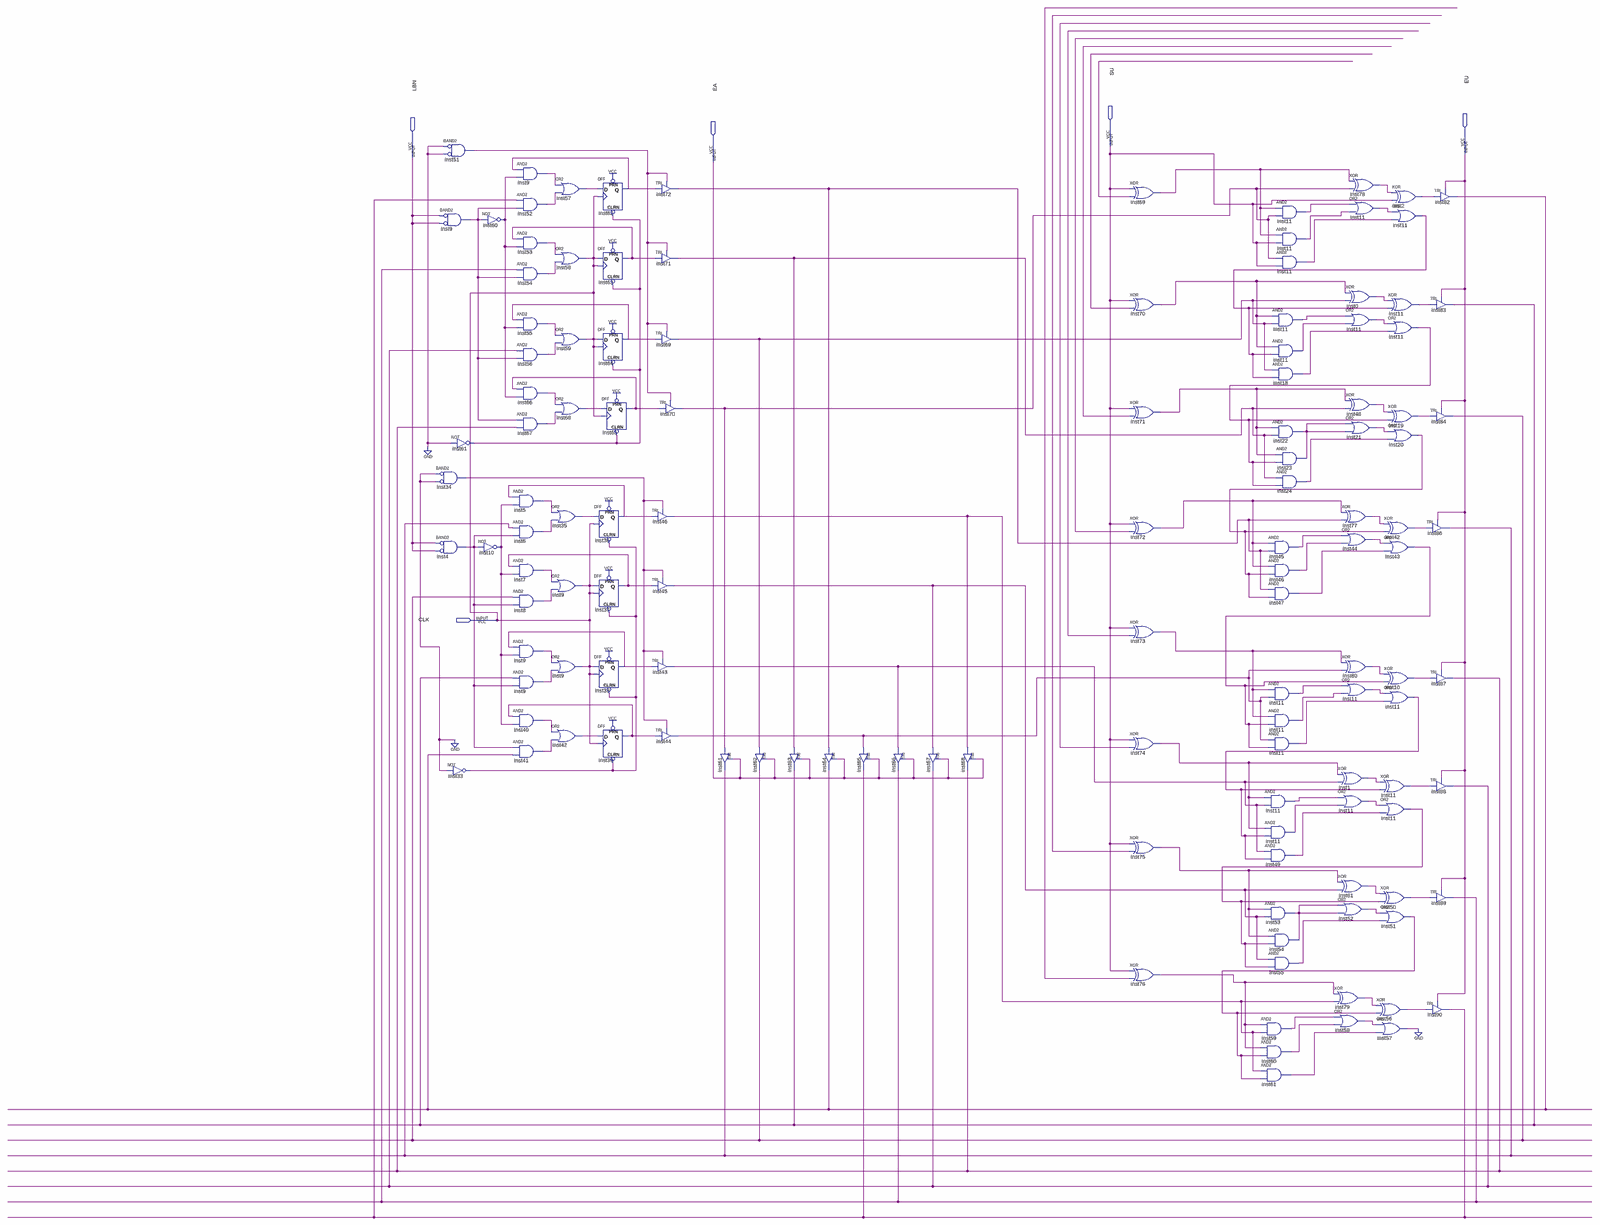
[diagram p0: schematic sheet, whole]
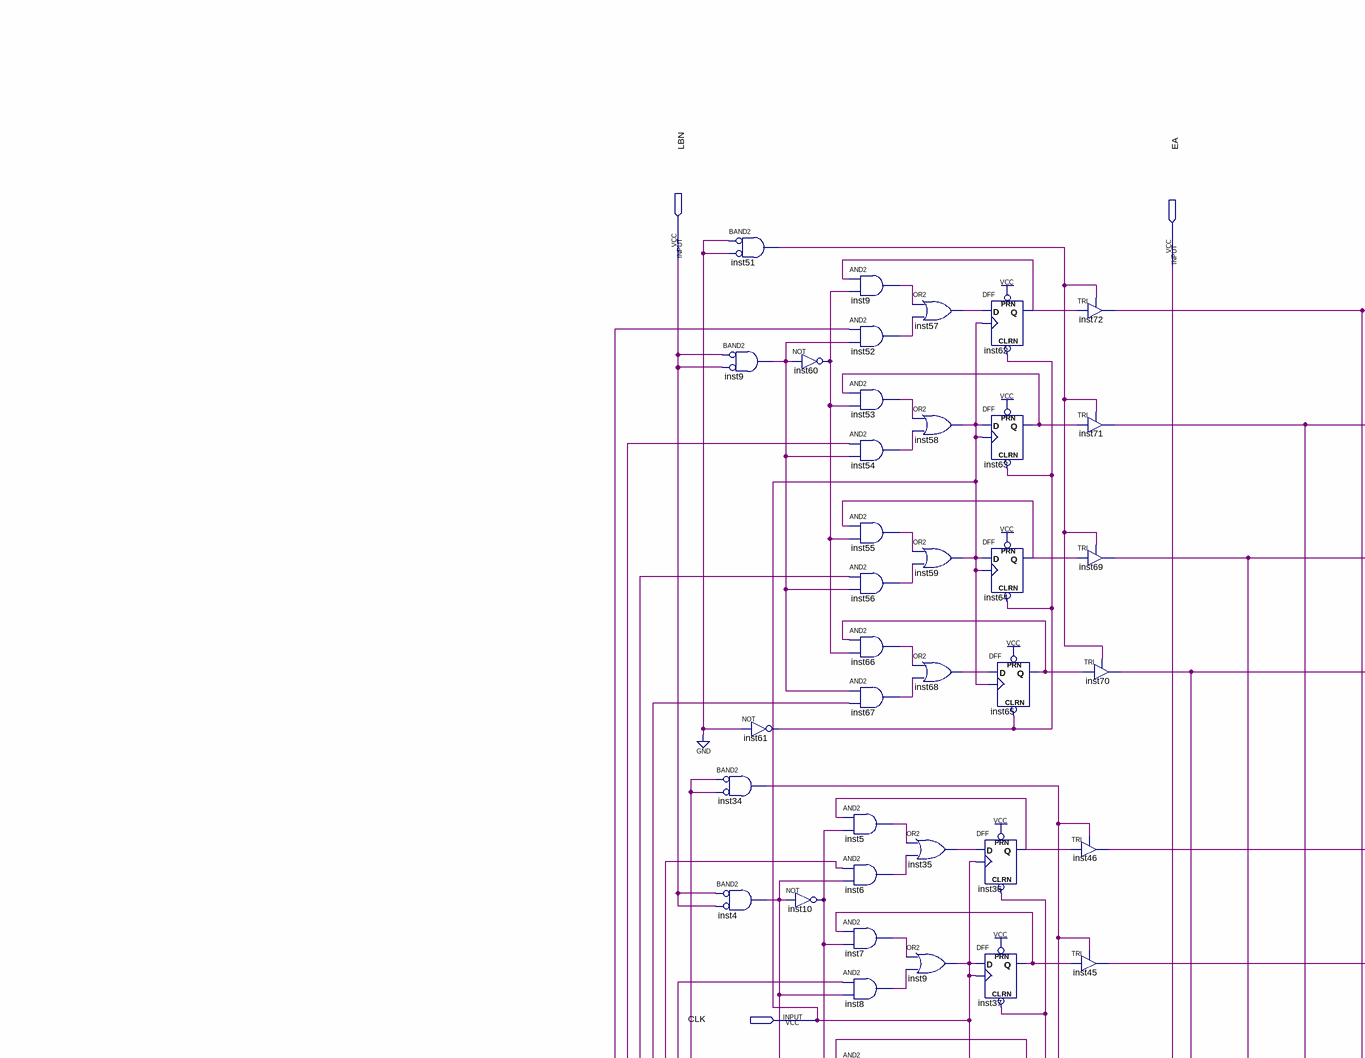
[diagram p1: schematic sheet, upper left part]
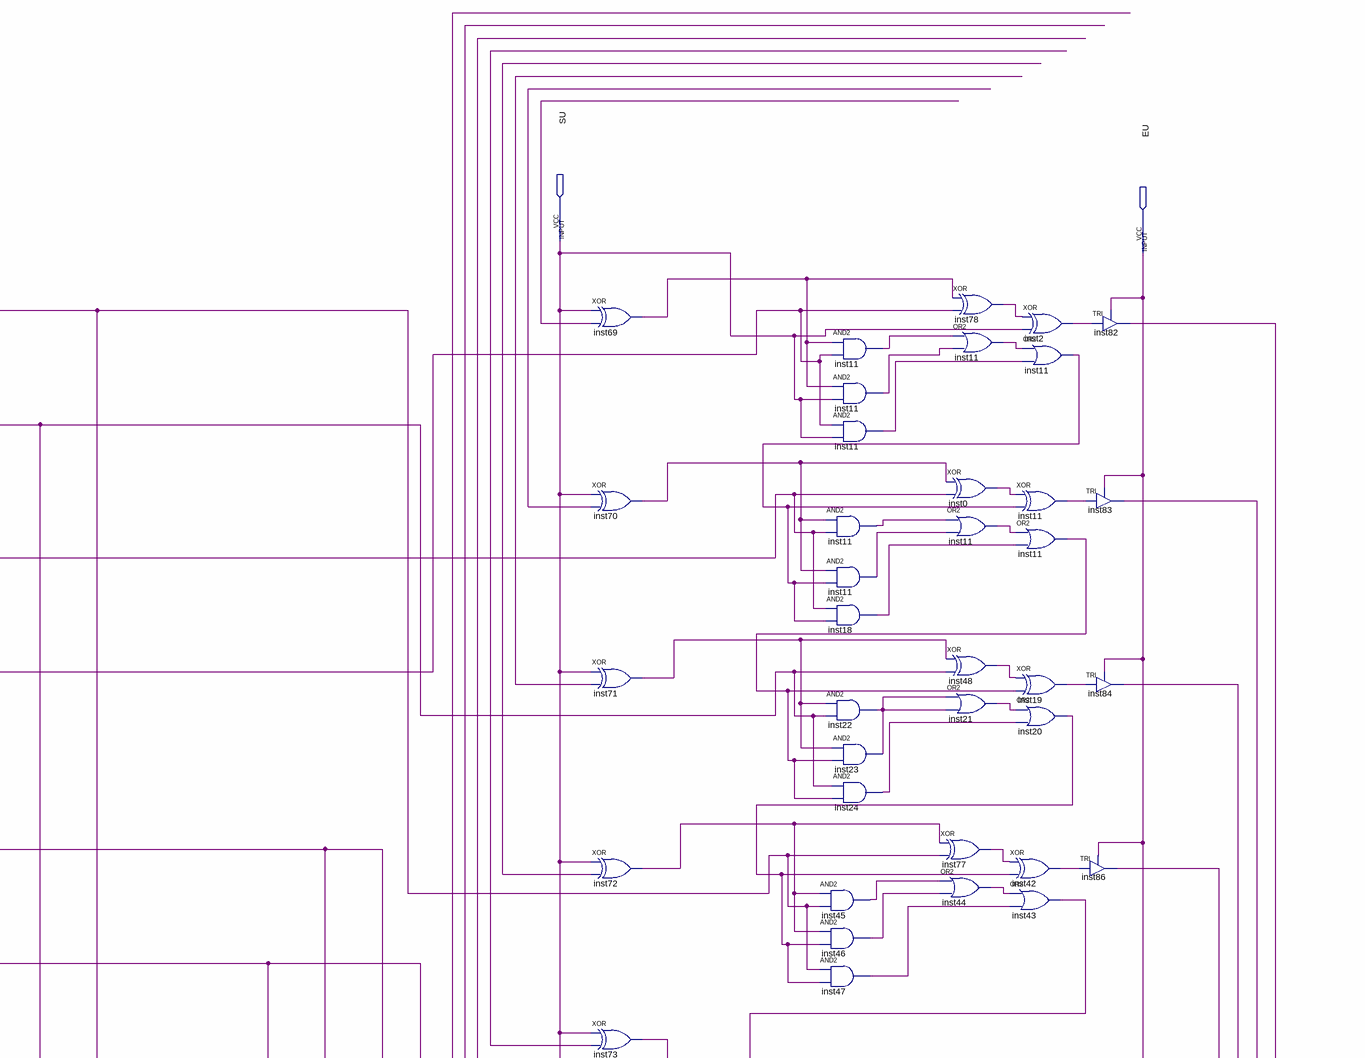
[diagram p2: schematic sheet, upper right part]
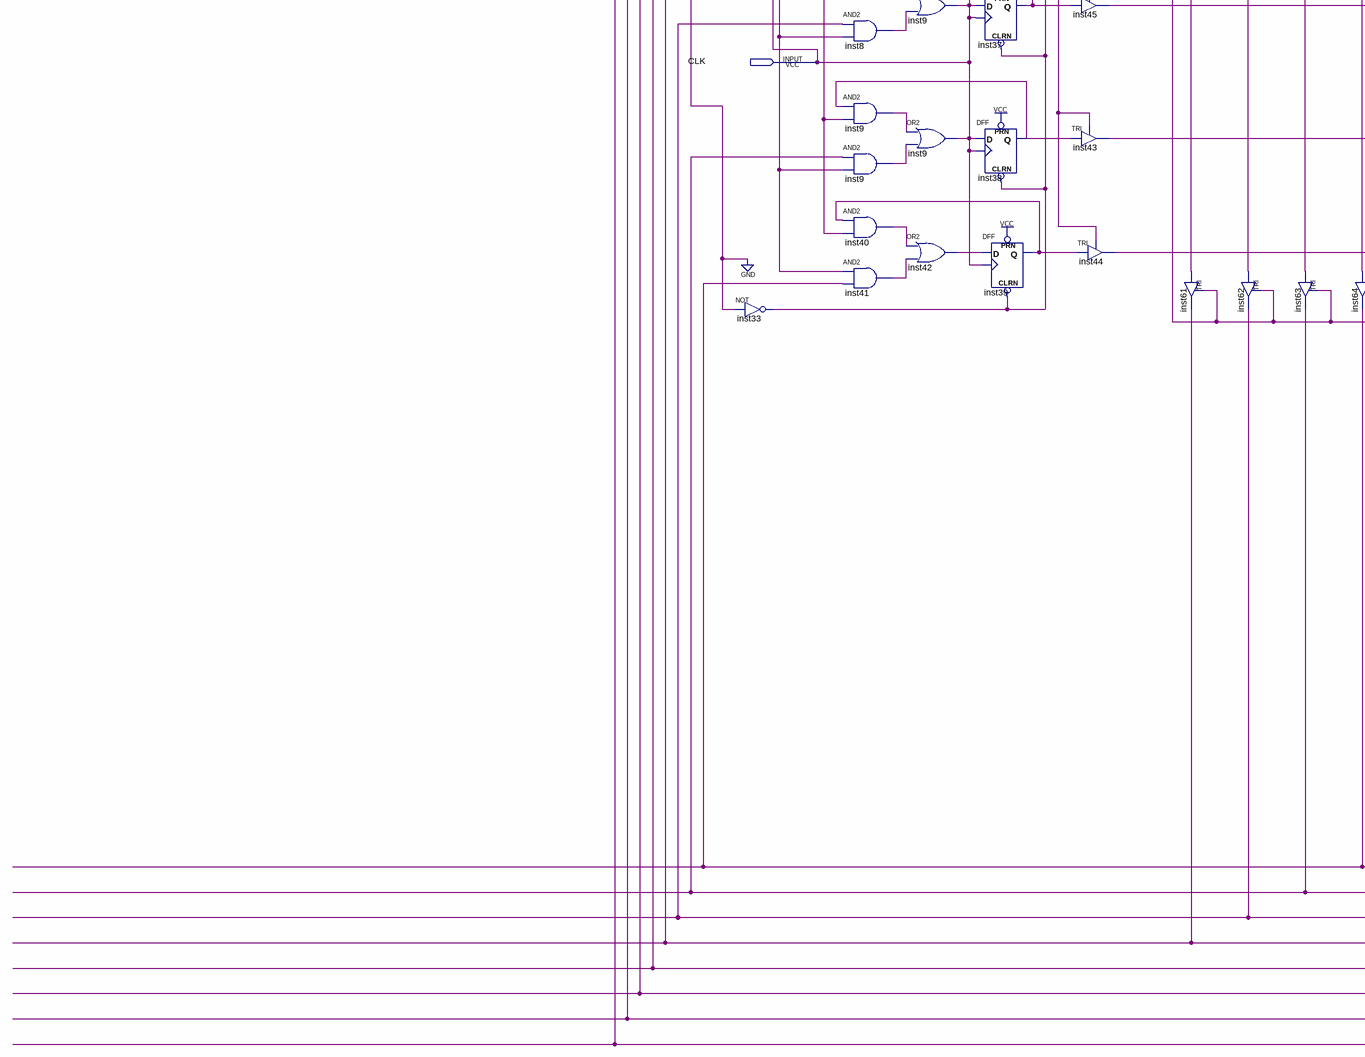
[diagram p3: schematic sheet, lower left part]
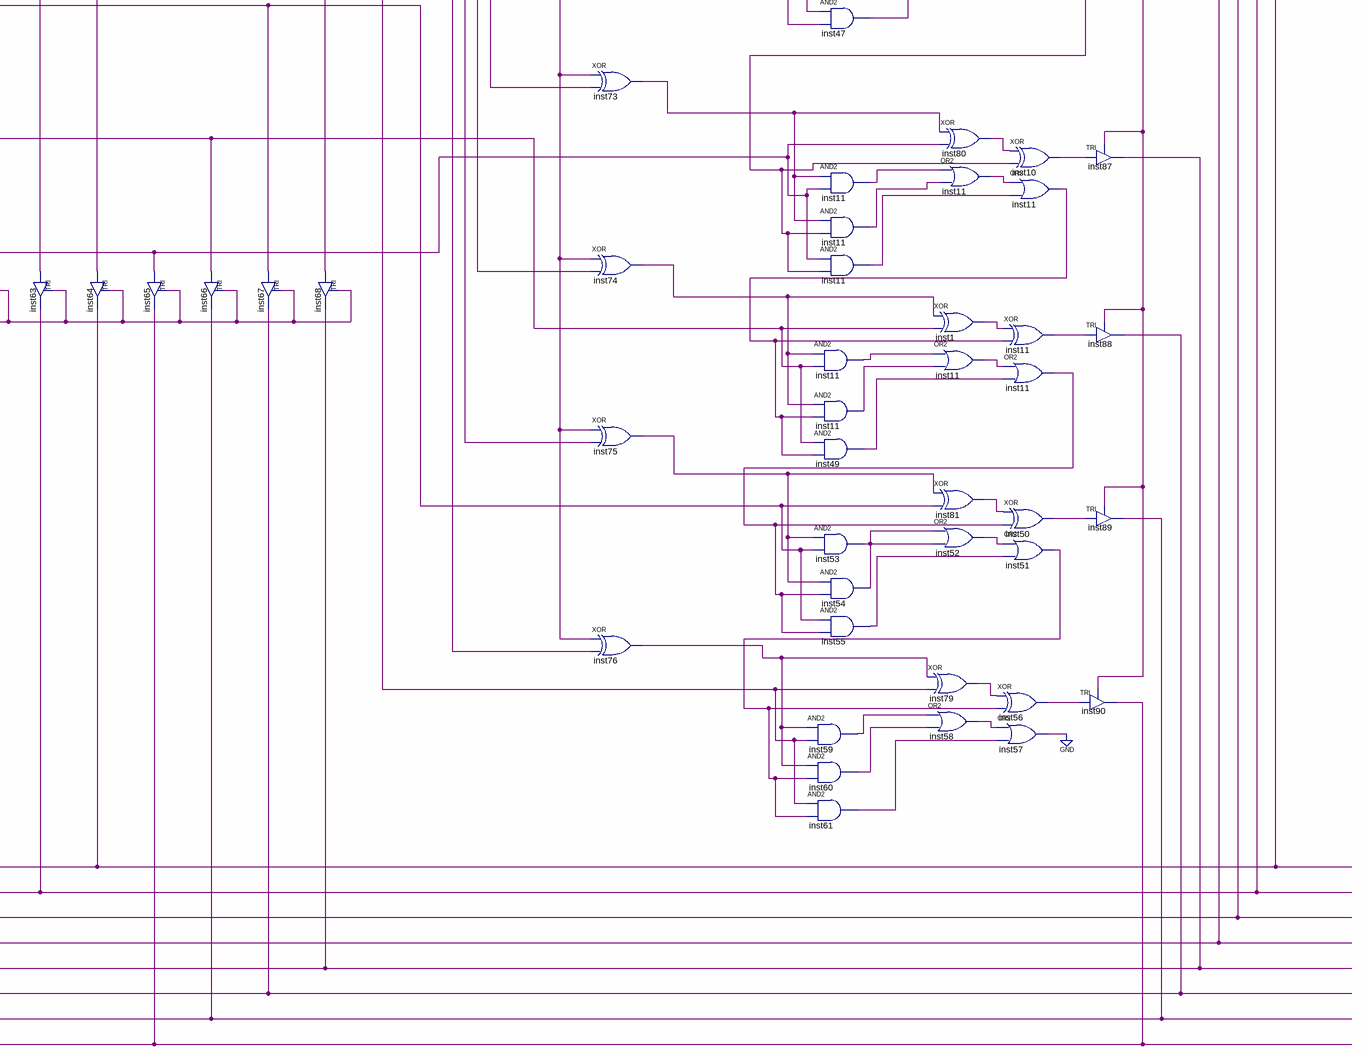
[diagram p4: schematic sheet, lower right part]
// Quartus schematic Somador_subtrador_acumulador.bdf as structural Verilog: 128 symbols, 5 pins
module Somador_subtrador_acumulador (
  input  SU,
  input  EU,
  input  LBN,
  input  EA,
  input  CLK
);

  wire inst0_out, inst1_out, inst2_out, inst4_out, inst5_out, inst6_out, inst7_out, inst8_out, inst9_out,
       inst9_out_2, inst9_out_3, inst9_out_4, inst10_out, inst10_out_2, inst11_out, inst11_out_2,
       inst11_out_3, inst11_out_4, inst11_out_5, inst11_out_6, inst11_out_7, inst11_out_8, inst11_out_9,
       inst11_out_10, inst11_out_11, inst11_out_12, inst11_out_13, inst11_out_14, inst11_out_15,
       inst11_out_16, inst11_out_17, inst11_out_18, inst11_out_19, inst11_out_20, inst18_out, inst19_out,
       inst20_out, inst21_out, inst22_out, inst24_out, inst33_out, inst34_out, inst35_out, inst36_q,
       inst37_q, inst38_q, inst39_q, inst40_out, inst41_out, inst42_out, inst42_out_2, inst43_out,
       inst43_out_2, inst44_out, inst44_out_2, inst45_out, inst45_out_2, inst46_out, inst46_out_2,
       inst47_out, inst48_out, inst49_out, inst50_out, inst51_out, inst51_out_2, inst52_out, inst52_out_2,
       inst53_out, inst53_out_2, inst54_out, inst55_out, inst55_out_2, inst56_out, inst56_out_2, inst57_out,
       inst57_out_2, inst58_out, inst59_out, inst60_out, inst60_out_2, inst61_out, inst61_out_2,
       inst61_out_3, inst62_out, inst62_q, inst63_out, inst63_q, inst64_out, inst64_q, inst65_out, inst65_q,
       inst66_out, inst66_out_2, inst67_out, inst67_out_2, inst68_out, inst68_out_2, inst69_out,
       inst69_out_2, inst70_out, inst70_out_2, inst71_out, inst71_out_2, inst72_out, inst72_out_2,
       inst73_out, inst74_out, inst75_out, inst76_out, inst77_out, inst78_out, inst79_out, inst80_out,
       inst81_out, undriven, undriven_2, undriven_3, undriven_4, undriven_5, undriven_6, undriven_7,
       undriven_8;

  and inst51 (inst51_out, ~1'b0, ~1'b0);  // BAND2
  and inst9 (inst9_out_4, ~LBN, ~LBN);  // BAND2
  not inst61 (inst61_out, 1'b0);
  and inst34 (inst34_out, ~1'b0, ~1'b0);  // BAND2
  and inst4 (inst4_out, ~LBN, ~LBN);  // BAND2
  not inst33 (inst33_out, 1'b0);
  not inst60 (inst60_out, inst9_out_4);
  not inst10 (inst10_out, inst4_out);
  and inst5 (inst5_out, inst36_q, inst10_out);
  and inst6 (inst6_out, inst61_out_3, inst4_out);
  and inst7 (inst7_out, inst37_q, inst10_out);
  and inst8 (inst8_out, inst62_out, inst4_out);
  and inst9_dup2 (inst9_out_2, inst38_q, inst10_out);
  and inst9_dup3 (inst9_out, inst63_out, inst4_out);
  and inst40 (inst40_out, inst39_q, inst10_out);
  and inst41 (inst41_out, inst4_out, inst64_out);
  and inst9_dup4 (inst9_out_3, inst62_q, inst60_out);
  and inst52 (inst52_out, inst65_out, inst9_out_4);
  and inst53 (inst53_out, inst63_q, inst60_out);
  and inst54 (inst54_out, inst66_out_2, inst9_out_4);
  and inst55 (inst55_out, inst64_q, inst60_out);
  and inst56 (inst56_out, inst67_out_2, inst9_out_4);
  and inst66 (inst66_out, inst65_q, inst60_out);
  and inst67 (inst67_out, inst9_out_4, inst68_out_2);
  or inst57 (inst57_out, inst9_out_3, inst52_out);
  or inst58 (CLK, inst53_out, inst54_out);
  or inst59 (CLK, inst55_out, inst56_out);
  or inst68 (inst68_out, inst66_out, inst67_out);
  or inst35 (inst35_out, inst5_out, inst6_out);
  or inst9_dup5 (CLK, inst7_out, inst8_out);
  or inst9_dup6 (CLK, inst9_out_2, inst9_out);
  or inst42 (inst42_out, inst40_out, inst41_out);
  DFF inst62 (.CLRN(inst61_out), .CLK(CLK), .D(inst57_out), .PRN(1'b1), .Q(inst62_q));
  DFF inst63 (.CLRN(inst61_out), .CLK(CLK), .D(CLK), .PRN(1'b1), .Q(inst63_q));
  DFF inst64 (.CLRN(inst61_out), .CLK(CLK), .D(CLK), .PRN(1'b1), .Q(inst64_q));
  DFF inst65 (.CLRN(inst61_out), .CLK(CLK), .D(inst68_out), .PRN(1'b1), .Q(inst65_q));
  DFF inst36 (.CLRN(inst33_out), .CLK(CLK), .D(inst35_out), .PRN(1'b1), .Q(inst36_q));
  DFF inst37 (.CLRN(inst33_out), .CLK(CLK), .D(CLK), .PRN(1'b1), .Q(inst37_q));
  DFF inst38 (.CLRN(inst33_out), .CLK(CLK), .D(CLK), .PRN(1'b1), .Q(inst38_q));
  DFF inst39 (.CLRN(inst33_out), .CLK(CLK), .D(inst42_out), .PRN(1'b1), .Q(inst39_q));
  TRI inst72 (.IN(inst62_q), .OE(inst51_out), .OUT(inst72_out));
  TRI inst71 (.IN(inst63_q), .OE(inst51_out), .OUT(inst71_out_2));
  TRI inst69 (.IN(inst64_q), .OE(inst51_out), .OUT(inst69_out_2));
  TRI inst70 (.IN(inst65_q), .OE(inst51_out), .OUT(inst70_out_2));
  TRI inst46 (.IN(inst36_q), .OE(inst34_out), .OUT(inst46_out));
  TRI inst45 (.IN(inst37_q), .OE(inst34_out), .OUT(inst45_out_2));
  TRI inst43 (.IN(inst38_q), .OE(inst34_out), .OUT(inst43_out_2));
  TRI inst44 (.IN(inst39_q), .OE(inst34_out), .OUT(inst44_out_2));
  TRI inst61_dup2 (.IN(inst70_out_2), .OE(EA), .OUT(inst61_out_3));
  TRI inst62_dup2 (.IN(inst69_out_2), .OE(EA), .OUT(inst62_out));
  TRI inst63_dup2 (.IN(inst71_out_2), .OE(EA), .OUT(inst63_out));
  TRI inst64_dup2 (.IN(inst72_out), .OE(EA), .OUT(inst64_out));
  TRI inst65_dup2 (.IN(inst44_out_2), .OE(EA), .OUT(inst65_out));
  TRI inst66_dup2 (.IN(inst43_out_2), .OE(EA), .OUT(inst66_out_2));
  TRI inst67_dup2 (.IN(inst45_out_2), .OE(EA), .OUT(inst67_out_2));
  TRI inst68_dup2 (.IN(inst46_out), .OE(EA), .OUT(inst68_out_2));
  xor inst69_dup2 (inst69_out, SU, undriven);
  xor inst70_dup2 (inst70_out, SU, undriven_2);
  xor inst71_dup2 (inst71_out, SU, undriven_3);
  xor inst72_dup2 (inst72_out_2, SU, undriven_4);
  xor inst73 (inst73_out, SU, undriven_5);
  xor inst74 (inst74_out, SU, undriven_6);
  xor inst75 (inst75_out, SU, undriven_7);
  xor inst76 (inst76_out, SU, undriven_8);
  and inst11 (inst11_out_6, inst69_out, inst70_out_2);
  and inst11_dup2 (inst11_out_7, inst69_out, SU);
  and inst11_dup3 (inst11_out, inst70_out_2, SU);
  and inst11_dup4 (inst11_out_4, inst70_out, inst69_out_2);
  and inst11_dup5 (inst11_out_5, inst70_out, inst11_out_15);
  and inst18 (inst18_out, inst69_out_2, inst11_out_15);
  and inst22 (inst22_out, inst71_out, inst71_out_2);
  and inst23 (inst22_out, inst71_out, inst11_out_16);
  and inst24 (inst24_out, inst71_out_2, inst11_out_16);
  and inst45_dup2 (inst45_out, inst72_out_2, inst72_out);
  and inst46_dup2 (inst46_out_2, inst72_out_2, inst20_out);
  and inst47 (inst47_out, inst72_out, inst20_out);
  and inst11_dup6 (inst11_out_13, inst73_out, inst44_out_2);
  and inst11_dup7 (inst11_out_14, inst73_out, inst43_out);
  and inst11_dup8 (inst11_out_8, inst44_out_2, inst43_out);
  and inst11_dup9 (inst11_out_11, inst74_out, inst43_out_2);
  and inst11_dup10 (inst11_out_12, inst74_out, inst11_out_17);
  and inst49 (inst49_out, inst43_out_2, inst11_out_17);
  and inst53_dup2 (inst53_out_2, inst75_out, inst45_out_2);
  and inst54_dup2 (inst53_out_2, inst75_out, inst11_out_18);
  and inst55_dup2 (inst55_out_2, inst45_out_2, inst11_out_18);
  and inst59_dup2 (inst59_out, inst76_out, inst46_out);
  and inst60_dup2 (inst60_out_2, inst76_out, inst51_out_2);
  and inst61_dup3 (inst61_out_2, inst46_out, inst51_out_2);
  xor inst0 (inst0_out, inst70_out, inst69_out_2);
  or inst11_dup11 (inst11_out_3, inst11_out_4, inst11_out_5);
  xor inst48 (inst48_out, inst71_out, inst71_out_2);
  or inst21 (inst21_out, inst22_out, inst22_out);
  xor inst77 (inst77_out, inst72_out_2, inst72_out);
  or inst44_dup2 (inst44_out, inst45_out, inst46_out_2);
  xor inst80 (inst80_out, inst73_out, inst44_out_2);
  or inst11_dup12 (inst11_out_9, inst11_out_13, inst11_out_14);
  xor inst1 (inst1_out, inst74_out, inst43_out_2);
  or inst11_dup13 (inst11_out_10, inst11_out_11, inst11_out_12);
  xor inst81 (inst81_out, inst75_out, inst45_out_2);
  or inst52_dup2 (inst52_out_2, inst53_out_2, inst53_out_2);
  xor inst79 (inst79_out, inst76_out, inst46_out);
  or inst58_dup2 (inst58_out, inst59_out, inst60_out_2);
  xor inst78 (inst78_out, inst69_out, inst70_out_2);
  or inst11_dup14 (inst11_out_2, inst11_out_6, inst11_out_7);
  xor inst56_dup2 (inst56_out_2, inst79_out, inst51_out_2);
  or inst57_dup2 (inst57_out_2, inst58_out, inst61_out_2);
  xor inst2 (inst2_out, inst78_out, SU);
  or inst11_dup15 (inst11_out_15, inst11_out_2, inst11_out);
  xor inst11_dup16 (inst11_out_19, inst0_out, inst11_out_15);
  or inst11_dup17 (inst11_out_16, inst11_out_3, inst18_out);
  xor inst19 (inst19_out, inst48_out, inst11_out_16);
  or inst20 (inst20_out, inst21_out, inst24_out);
  xor inst42_dup2 (inst42_out_2, inst77_out, inst20_out);
  or inst43_dup2 (inst43_out, inst44_out, inst47_out);
  xor inst10_dup2 (inst10_out_2, inst80_out, inst43_out);
  or inst11_dup18 (inst11_out_17, inst11_out_9, inst11_out_8);
  xor inst11_dup19 (inst11_out_20, inst1_out, inst11_out_17);
  or inst11_dup20 (inst11_out_18, inst11_out_10, inst49_out);
  xor inst50 (inst50_out, inst81_out, inst11_out_18);
  or inst51_dup2 (inst51_out_2, inst52_out_2, inst55_out_2);
  TRI inst82 (.IN(inst2_out), .OE(EU), .OUT(inst64_out));
  TRI inst83 (.IN(inst11_out_19), .OE(EU), .OUT(inst63_out));
  TRI inst84 (.IN(inst19_out), .OE(EU), .OUT(inst62_out));
  TRI inst86 (.IN(inst42_out_2), .OE(EU), .OUT(inst61_out_3));
  TRI inst87 (.IN(inst10_out_2), .OE(EU), .OUT(inst68_out_2));
  TRI inst88 (.IN(inst11_out_20), .OE(EU), .OUT(inst67_out_2));
  TRI inst89 (.IN(inst50_out), .OE(EU), .OUT(inst66_out_2));
  TRI inst90 (.IN(inst56_out_2), .OE(EU), .OUT(inst65_out));
  // also tied to GND on the sheet: inst57_out_2
endmodule
